# EasyEDA Pro project 空中鼠标发射端.epro

# Schematic 空中鼠标发射端
Board Name: 空中鼠标发射端; Create Date: 2025-04-13; Page Name: P1; Project Name: 空中鼠标; Schematic Name: 空中鼠标发射端; Update Date: 2025-04-16; Company: 嘉立创EDA; Page Size: A4; Version: V1.0
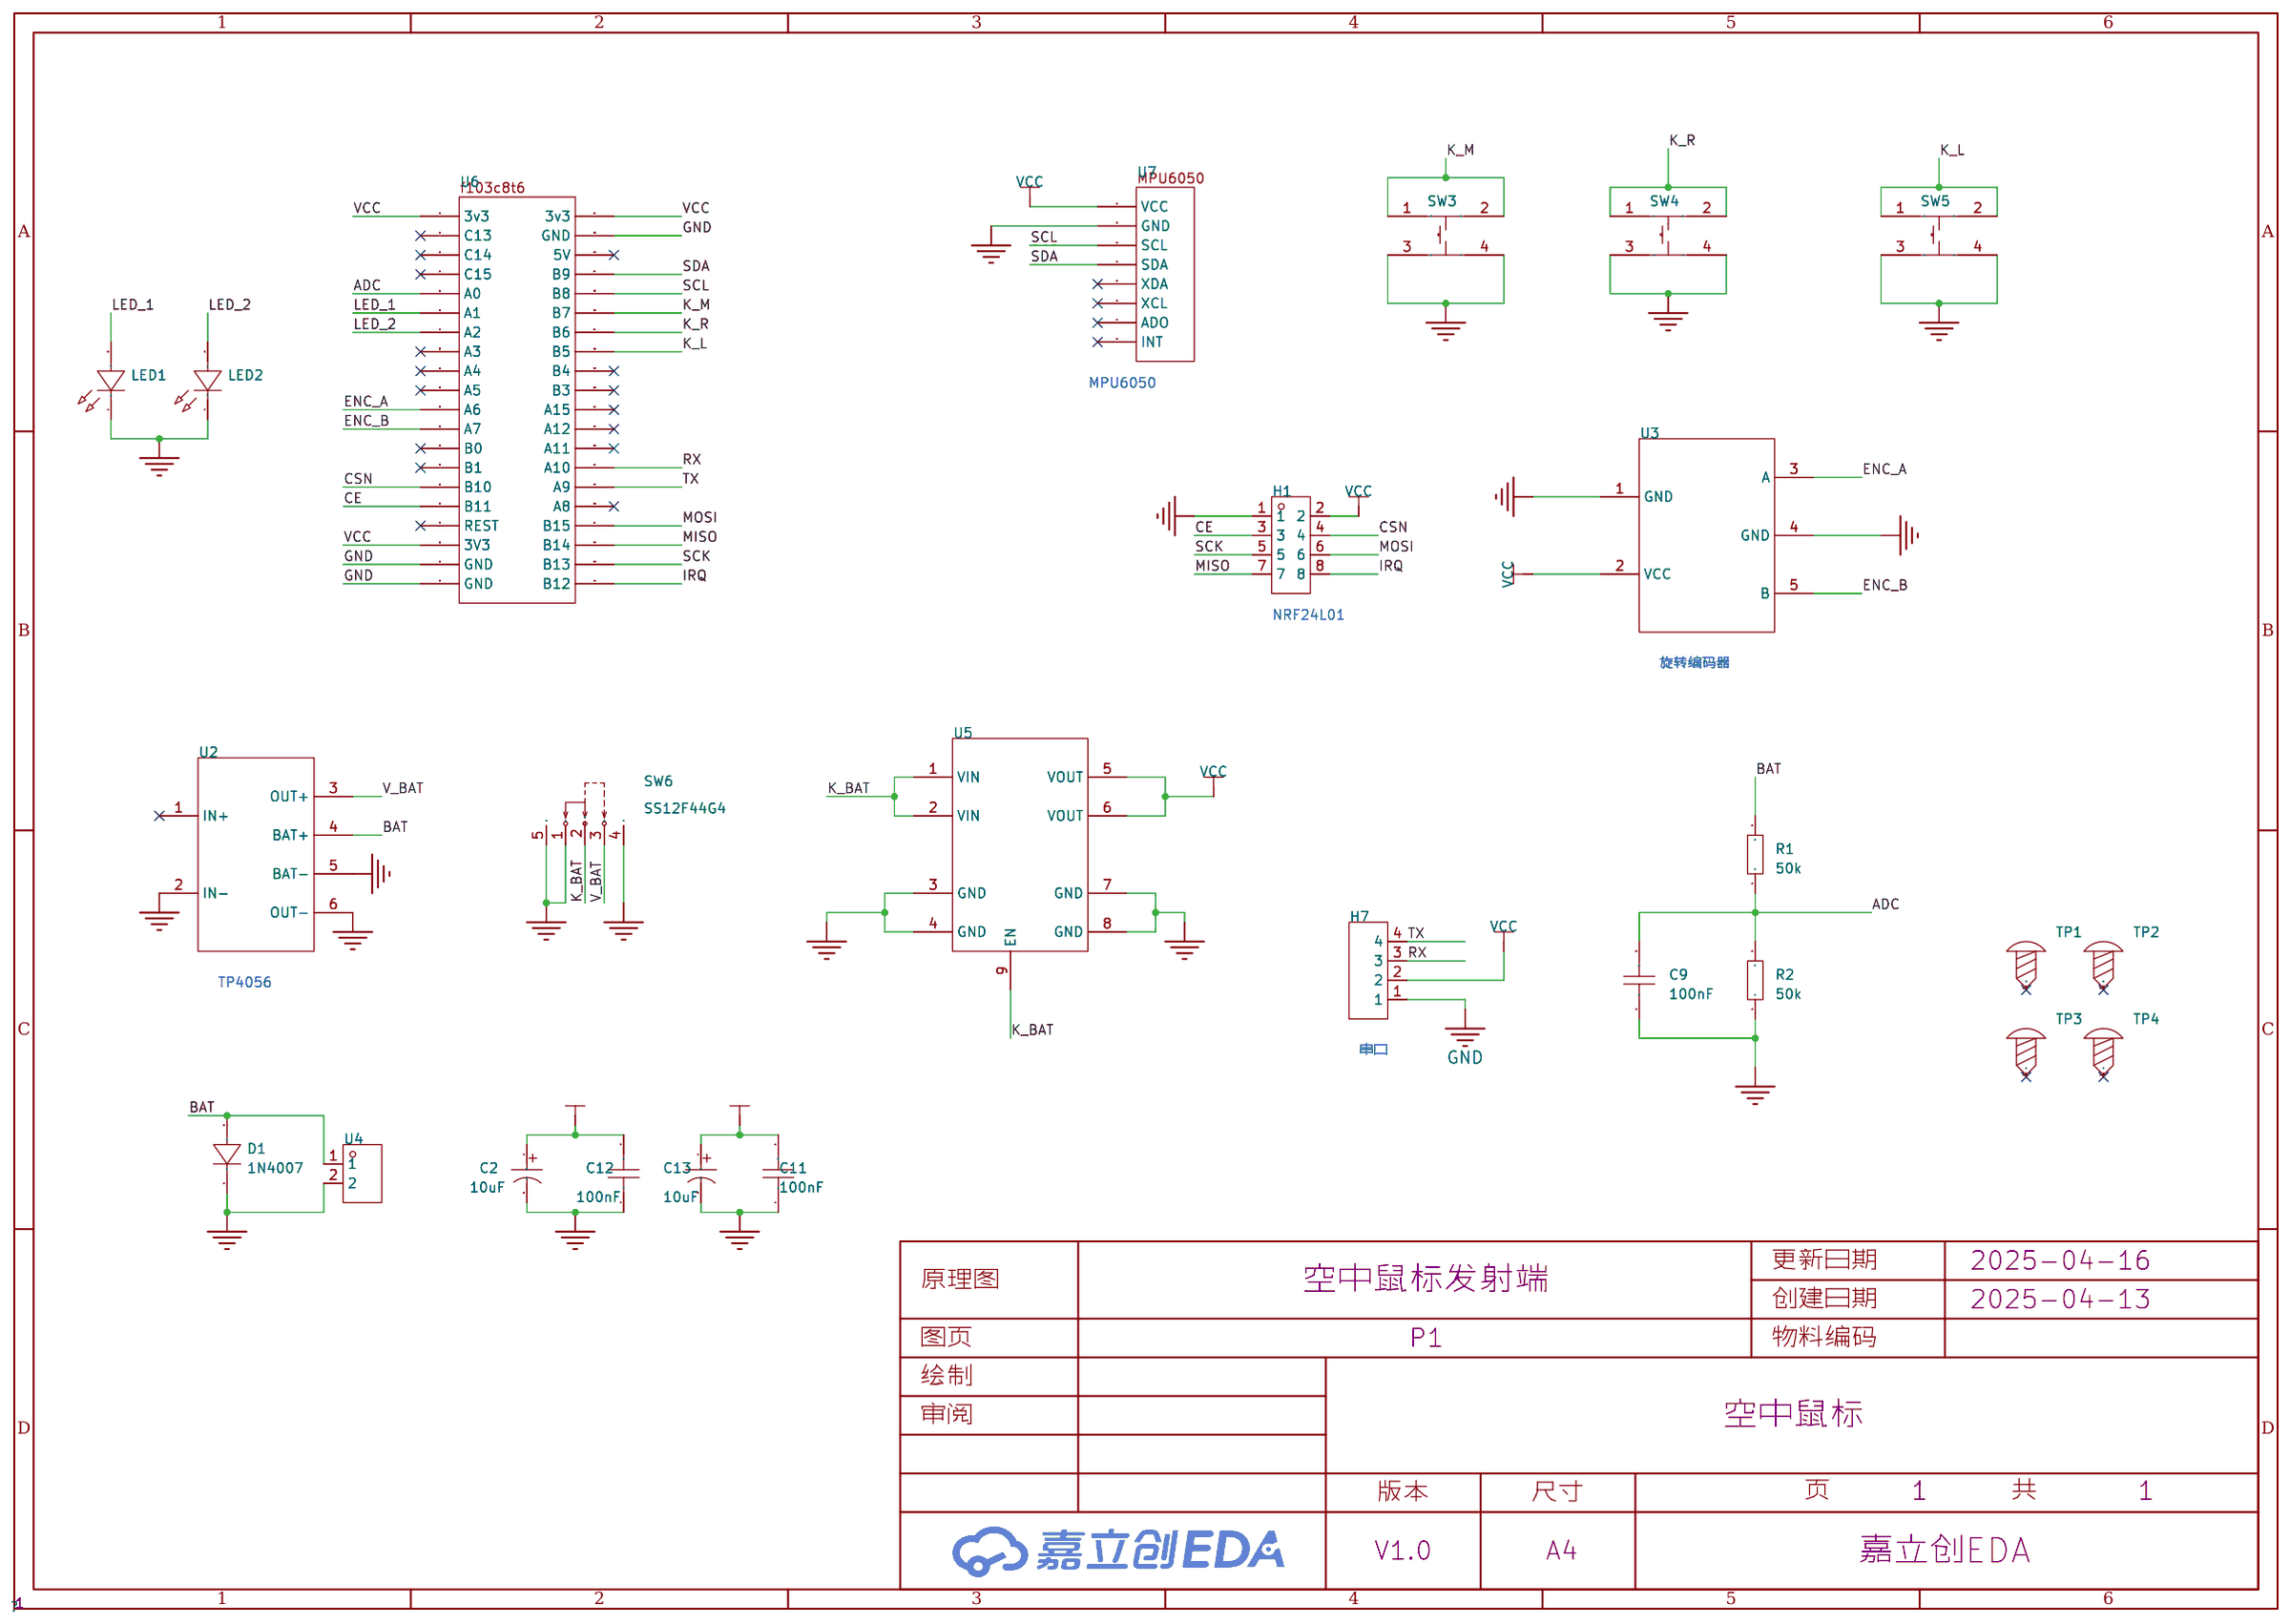
[diagram p0: schematic sheet]

## Parts
C2  10uF  [CAP-SMD_BD4.0-L4.3-W4.3-FD]
C9  100nF  [C0603]
C11  100nF  [C0603]
C12  100nF  [C0603]
C13  10uF  [CAP-SMD_BD4.0-L4.3-W4.3-FD]
D1  1N4007  [SMA_L4.3-W2.5-LS5.0-RD]
H1  NRF24L01  [HDR-TH_8P-P2.54-V-F-R2-C4-S2.54]
H7  -  [HDR-TH_4P-P2.54-V-M]
LED1  521-9210F  [LED-TH_BD3.0-P2.54-RD]
LED2  521-9210F  [LED-TH_BD3.0-P2.54-RD]
R1  50k  [R0603]
R2  50k  [R0603]
SCREW1  TP1  [M3螺丝]
SCREW2  TP2  [M3螺丝]
SCREW3  TP3  [M3螺丝]
SCREW4  TP4  [M3螺丝]
SW3  TS-1002-07026  [SW-TH_4P-L6.0-W6.0-P4.50-LS6.5]
SW4  TS-1002-07026  [SW-TH_4P-L6.0-W6.0-P4.50-LS6.5]
SW5  TS-1002-07026  [SW-TH_4P-L6.0-W6.0-P4.50-LS6.5]
SW6  SS12F44G4  [SW-TH_SHOU-HAN_SS12F44G4]
U2  -  [TP4056]
U3  -  [旋转编码器]
U4  XY-XHB2.54-2A21  [HDR-TH_2P-P2.50-H-F-W7.3-N]
U5  -  [TPS63000]
U6  -  [stm32f103c8t6最小系统板]
U7  -  [MPU6050]

## Library data of the parts
C2 C13 = RVT1V100M0405_C72485: 容值:10uF;精度:±20%;额定电压:35V;纹波电流:15mA@120Hz;等效串联电阻(ESR):-;; LCSC Part Name: 10uF ±20% 35V; Supplier Part: C72485; Manufacturer: ROQANG(容强); Manufacturer Part: RVT1V100M0405; Supplier Footprint: SMD,D4xL5.4mm; JLCPCB Part Class: 扩展库; Datasheet: https://atta.szlcsc.com/upload/public/pdf/source/20170325/1490427950282.pdf; Supplier: LCSC; Tolerance: ±20%; Voltage Rating: 35V; Ripple Current: 15mA@120Hz; Diameter: 4mm; Height - Seated (Max): 5.4mm; Lifetime: 2000hrs@105℃; Operating Temperature: -40℃~+105℃
C9 = CAP_0603: Supplier Footprint: 0603
C11 C12 = CC0603KRX7R9BB104: 容值:100nF;精度:±10%;额定电压:50V;材质(温度系数):X7R;; LCSC Part Name: 100nF ±10% 50V; Supplier Part: C14663; Manufacturer: YAGEO(国巨); Supplier Footprint: 0603; JLCPCB Part Class: 基础库; Datasheet: https://atta.szlcsc.com/upload/public/pdf/source/20180910/C282072_33301C7F631E79921B82A8DAC6BCC5B3.pdf; Supplier: LCSC; Tolerance: ±10%; Voltage Rated: 50V; Temperature Coefficient: X7R
D1 = 1N4007_C727081: 二极管配置:独立式;正向压降(Vf):1.1V@1A;直流反向耐压(Vr):1kV;整流电流:1A;; Supplier Part: C727081; Manufacturer: TWGMC(台湾迪嘉); Supplier Footprint: SMA(DO-214AC); JLCPCB Part Class: 扩展库; Datasheet: https://atta.szlcsc.com/upload/public/pdf/source/20200828/C727079_3A05254382567072883400655AE0ED46.pdf; Supplier: LCSC; Diode Configuration: 独立式; Forward Voltage (Vf@If): 1.1V@1A; Reverse Voltage (Vr): 1kV; Rectified Current: 1A; Reverse Leakage Current (Ir): 5uA
H1 = PM254V-12-08-H85: 插孔结构:2x4P;间距:2.54mm;行距:2.54mm;圆孔/方孔:方孔;安装类型:直插;排数:双排;总孔位数:8P;额定电流:3A;额定电压:250V;插孔方向:顶部;塑高:8.5mm;工作温度范围:-40℃~+105℃;; LCSC Part Name: 间距:2.54mm 2x4P 直插; Supplier Part: C2834799; Manufacturer: XFCN(兴飞); Supplier Footprint: 插件,P=2.54mm; JLCPCB Part Class: 扩展库; Datasheet: https://atta.szlcsc.com/upload/public/pdf/source/20200309/C492399_8C441E2934FBB604A89B37A68AA45ECF.pdf; Supplier: LCSC; Holes Structure: 2x4P; Pitch: 2.54mm; Row Spacing: 2.54mm; Circular Hole / Square Hole: 方孔; Mounting Type: 直插; Number of Rows: 双排; Number of Holes: 8P; Current Rating (Max): 3A; Voltage Rating (Max): 250V; Holes Direction: 顶部; Insulation Height: 8.5mm; Operating Temperature Range: -40℃~+105℃
H7 = HDR-M_2.54_1x4P: Supplier Part: C492403; Supplier Footprint: 插件
LED1 LED2 = 521-9210F: Supplier Part: C6075075; Manufacturer: Dialight; Supplier Footprint: 插件; Datasheet: https://atta.szlcsc.com/upload/public/pdf/source/20190108/C350939_6833FC1F7AEE099A9F4F0B49B6235C3A.pdf; Supplier: LCSC
R1 R2 = Res_0603: Supplier Footprint: 0603
SCREW1-SCREW4 = M3螺丝: Supplier Footprint: 插件
SW3-SW5 = TS-1002-07026: 电路结构:单刀单掷;按钮形状:圆形按钮;安装方式:直插;开关长度:6mm;开关宽度:6mm;开关高度:7mm;触点电流:50mA;额定电压(DC):12V;带灯:-;机械寿命:-;; LCSC Part Name: 6*6*7mm 直插 轻触开关; Supplier Part: C455095; Manufacturer: XUNPU(讯普); Supplier Footprint: 插件,6x6mm; JLCPCB Part Class: 扩展库; Datasheet: https://atta.szlcsc.com/upload/public/pdf/source/20231108/52BC6409AB52B6746CCC051A15664904.pdf; Supplier: LCSC; Circuit: 单刀单掷; Actuator Style: 圆形按钮; Mounting Style: 直插; Switch Length: 6mm; Switch Width: 6mm; Switch Height: 7mm; Contact Current: 50mA; Voltage Rating (DC): 12V
SW6 = SS12F44G4: 电路结构:单刀双掷;安装方式:直插;开关颜色:-;额定电流(DC):300mA;额定电压(DC):50V;额定电流(AC):-;额定电压(AC):-;机械寿命:5千次;; Supplier Part: C2887261; Manufacturer: SHOU HAN(首韩); Supplier Footprint: 插件; JLCPCB Part Class: 扩展库; Datasheet: https://atta.szlcsc.com/upload/public/pdf/source/20210820/C87A250874D550AF2167CED4FCF38A85.pdf; Supplier: LCSC; Circuit: 单刀双掷; Pin Style: PC引脚; Switch Length: 12mm; Switch Width: 4.5mm; Switch Height: 6mm; Mounting Style: 直插; Current Rating (DC): 300mA; Voltage Rating (DC): 50V; Mechanical Life: 5千次; Operating Temperature: -10℃~+50℃
U2 = TP4056模块
U3 = 旋转编码器
U4 = XY-XHB2.54-2A21: 插针结构:1x2P;间距:2.54mm;安装方式:弯插;总PIN数:2P;排数:1;每排PIN数:2;行距:2.54mm;额定电流:2A;工作温度范围:-25℃~+85℃;; LCSC Part Name: 1x2P 间距:2.54mm 弯插; Supplier Part: C19271395; Manufacturer: XYECONN(辛译); Supplier Footprint: 弯插,P=2.54mm; JLCPCB Part Class: 扩展库; Datasheet: https://atta.szlcsc.com/upload/public/pdf/source/20231124/E581531705911B495C6E735B7C4EA3F8.pdf; Supplier: LCSC; Pins Structure: 1x2P; Pitch: 2.54mm; Mounting Style: 弯插; Number of Pins: 2P; Number of Rows: 1; Number of PINs Per Row: 2; Row Spacing: 2.54mm; Current Rating (Max): 2A; Operating Temperature Range: -25℃~+85℃
U5 = TPS63000
U6 = stm32f103c8t6最小系统板
U7 = MPU6050

## Nets
GND: C2.2 C9.1 C11.1 C12.1 C13.2 D1.1(K) H1.1 H7.1 LED1.1(K) LED2.1(K) R2.1 SW3.3 SW3.4 SW4.3 SW4.4 SW5.3 SW5.4 SW6.1 SW6.4 SW6.5 U2.2(IN-) U2.5(BAT-) U2.6(OUT-) U3.1(GND) U3.4(GND) U4.2 U5.3(GND) U5.4(GND) U5.7(GND) U5.8(GND) U6.19(GND) U6.20(GND) U6.22(GND) U7.2(GND)
VCC: C11.2 C13.1 H1.2 H7.2 U3.2(VCC) U5.5(VOUT) U5.6(VOUT) U6.1(3v3) U6.18(3V3) U6.21(3v3) U7.1(VCC)
ADC: C9.2 R1.1 R2.2 U6.5(A0)
BAT: D1.2(A) R1.2 U2.4(BAT+) U4.1
CE: H1.3 U6.16(B11)
CSN: H1.4 U6.15(B10)
ENC_A: U3.3(A) U6.11(A6)
ENC_B: U3.5(B) U6.12(A7)
IRQ: H1.8 U6.40(B12)
K_BAT: C2.1 C12.2 SW6.2 U5.1(VIN) U5.2(VIN) U5.9(EN)
K_L: SW5.1 SW5.2 U6.28(B5)
K_M: SW3.1 SW3.2 U6.26(B7)
K_R: SW4.1 SW4.2 U6.27(B6)
LED_1: LED1.2(A) U6.6(A1)
LED_2: LED2.2(A) U6.7(A2)
MISO: H1.7 U6.38(B14)
MOSI: H1.6 U6.37(B15)
RX: H7.3 U6.34(A10)
SCK: H1.5 U6.39(B13)
SCL: U6.25(B8) U7.3(SCL)
SDA: U6.24(B9) U7.4(SDA)
TX: H7.4 U6.35(A9)
V_BAT: SW6.3 U2.3(OUT+)

Not connected (* = marked no-connect by the designer): SCREW1 1*; SCREW2 1*; SCREW3 1*; SCREW4 1*; U2 1(IN+)*; U6 2(C13)* 3(C14)* 4(C15)* 8(A3)* 9(A4)* 10(A5)* 13(B0)* 14(B1)* 17(REST)* 23(5V)* 29(B4)* 30(B3)* 31(A15)* 32(A12)* 33(A11)* 36(A8)*; U7 5(XDA)* 6(XCL)* 7(ADO)* 8(INT)*

## Notes on the sheet
- MPU6050
- NRF24L01
- 旋转编码器
- TP4056
- 串口

# Board PCB2_1
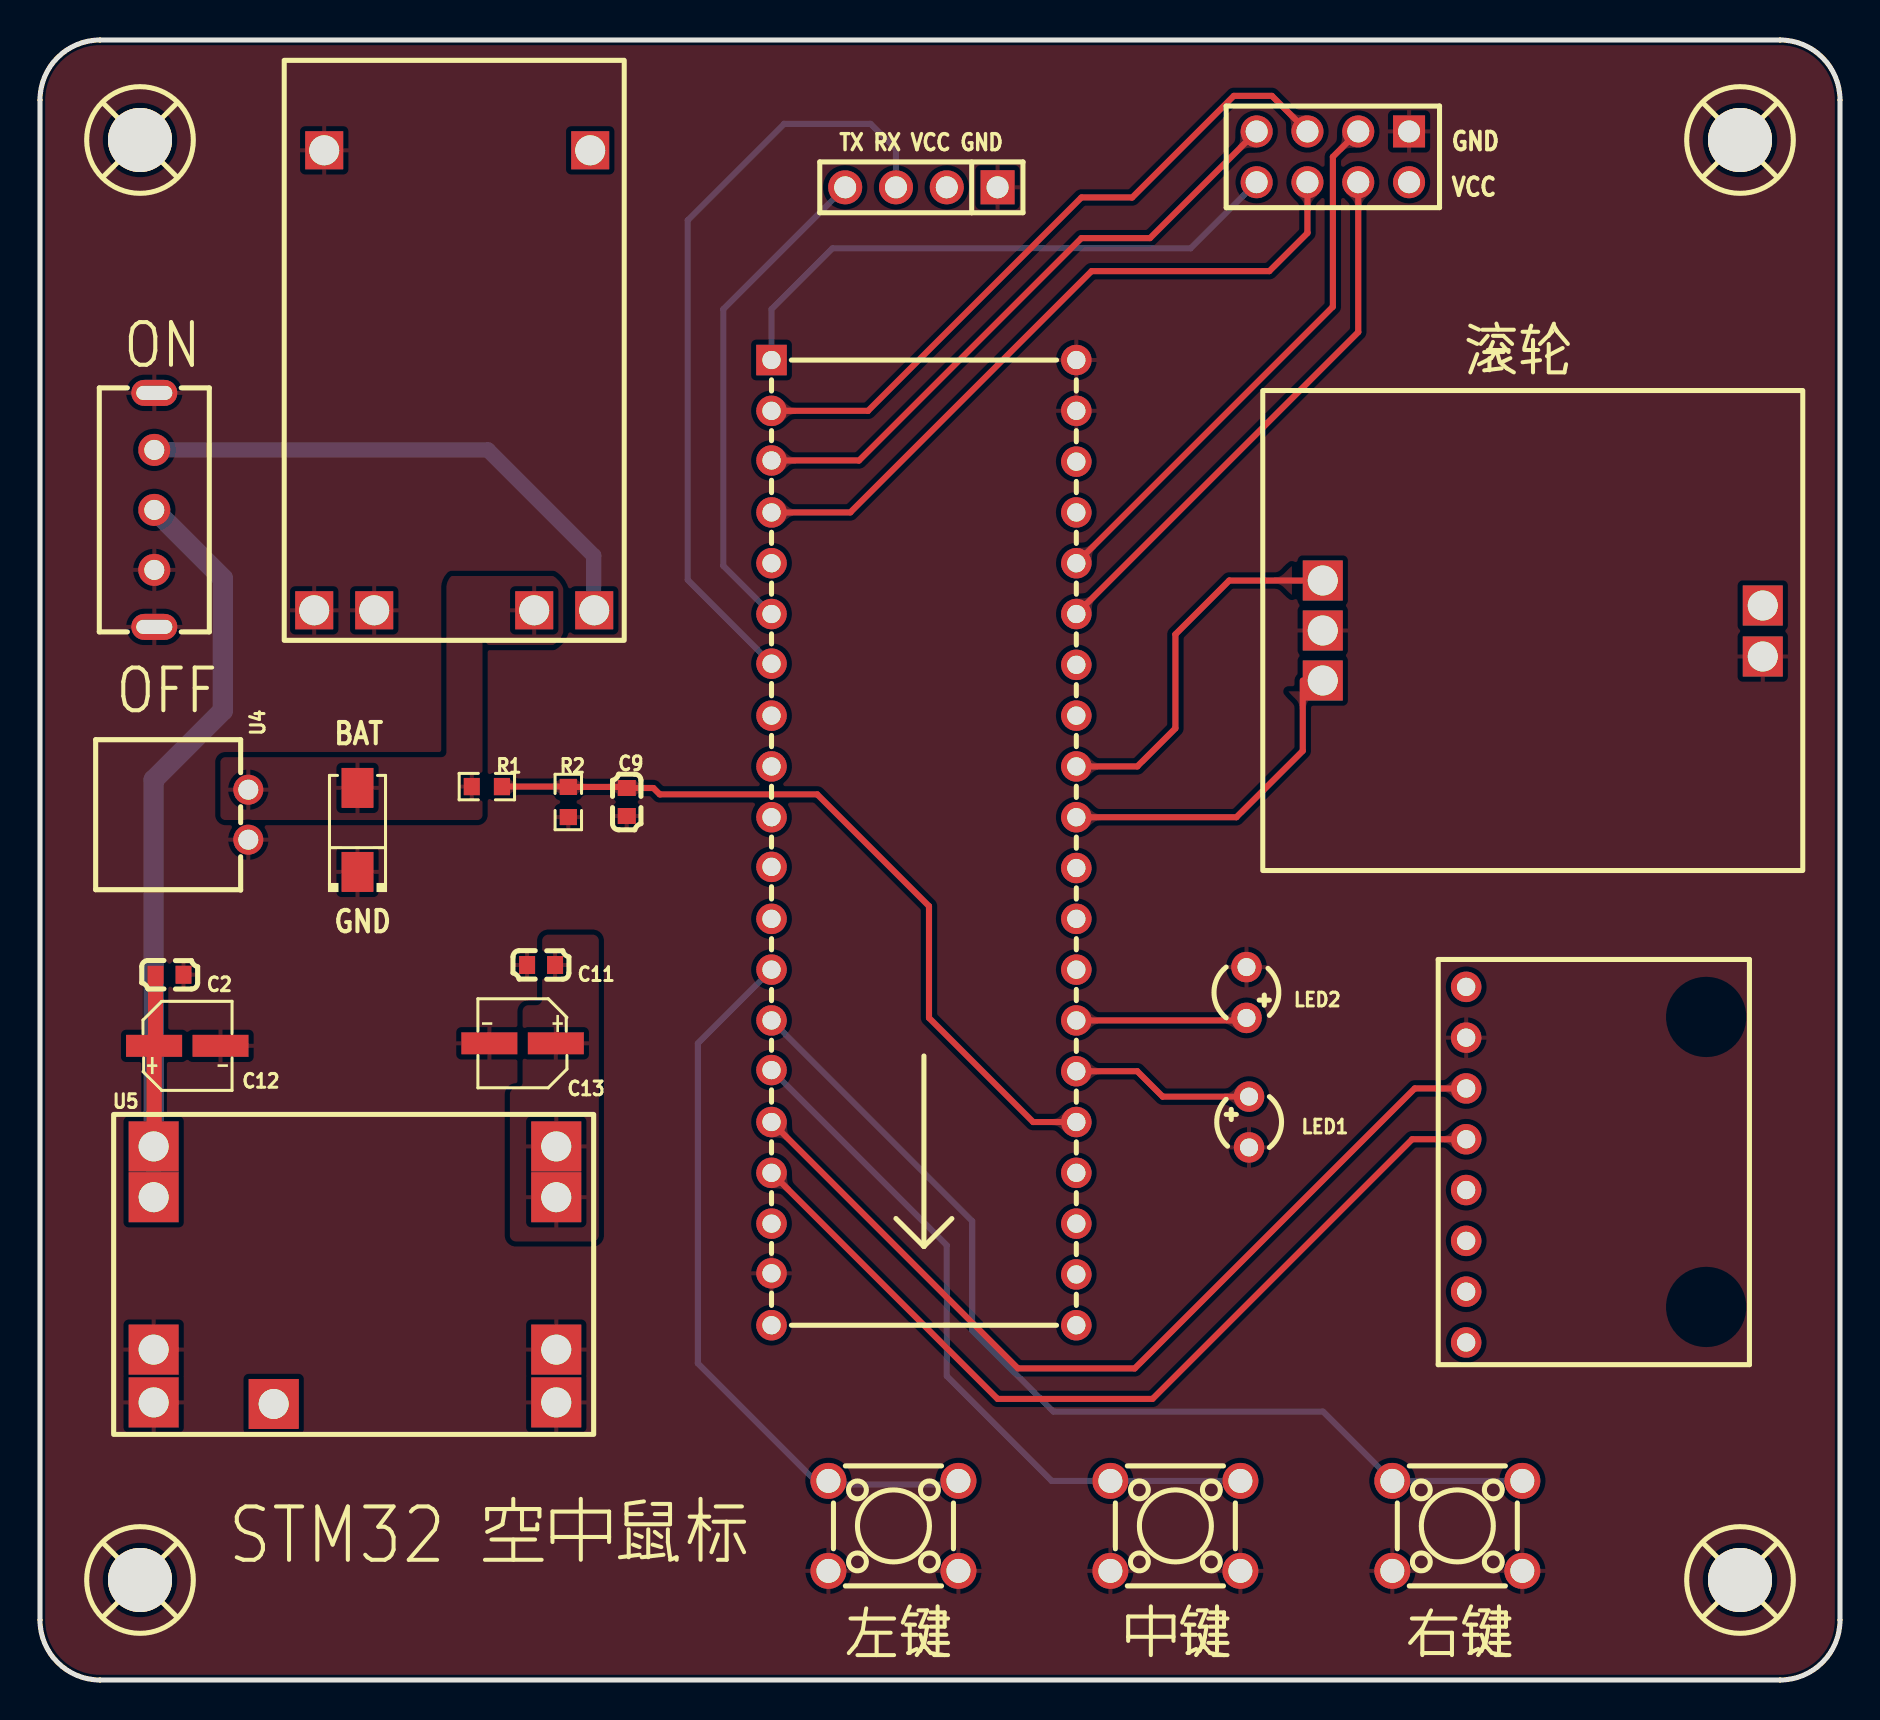
[diagram p1: board, top side]
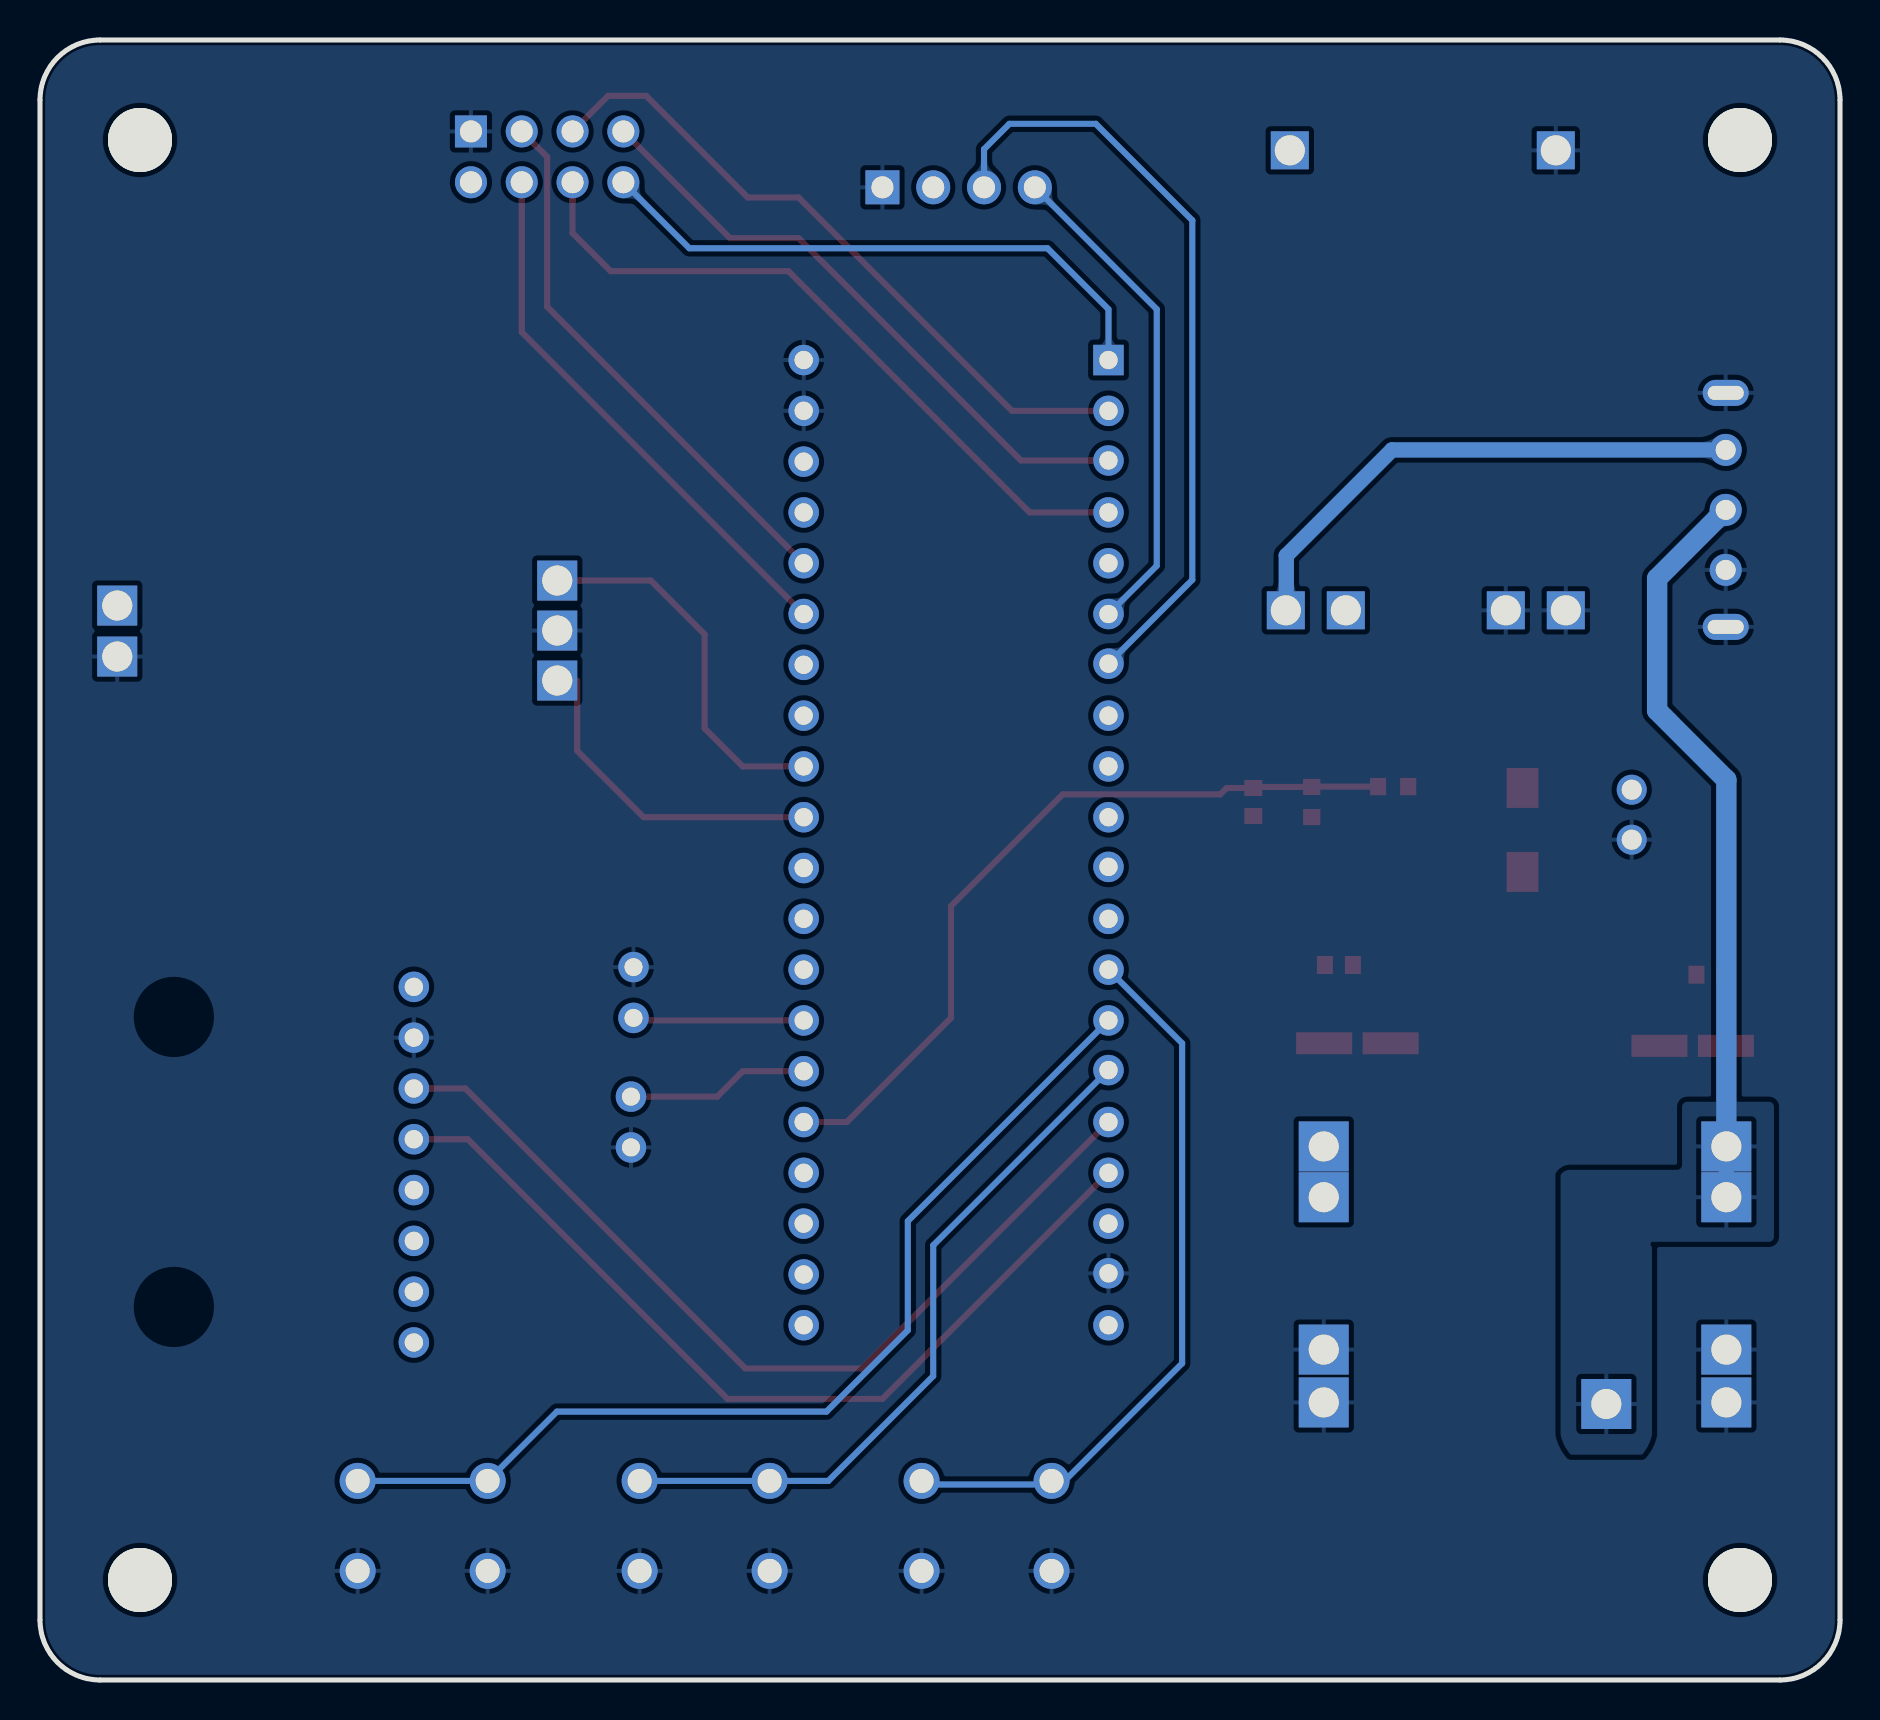
[diagram p2: board, bottom side, seen from below]

Outline 90 x 82 mm; copper layers: Top Layer, Inner1, Inner2, Bottom Layer. Coordinates in mm from the lower left corner of the outline.
Outline path: 0,79 0,3 arc(0.88,0.88) 3,0 87,0 arc(89.12,0.88) 90,3 90,79 arc(89.12,81.12) 87,82 3,82 arc(0.88,81.12) 0,79
Stack: Top Layer 0.035mm 外层铜厚1oz / Dielectric1 0.2104mm 7628 RC49% 8.6mil / Inner1 0.0152mm 内层铜厚 / Dielectric2 1.065mm 1.1mm H/HOZ Copper / Inner2 0.0152mm 内层铜厚 / Dielectric3 0.2104mm 7628 RC49% 8.6mil / Bottom Layer 0.035mm 外层铜厚1oz

## Design rules (mm)
template: 自定义配置
spacing copperThickness1oz (default): track to track 0.102, other pairs 0.152 to 0.3
spacing copperThickness2oz: track to track 0.203, other pairs 0.152 to 0.3
track width copperThickness1oz (default): min 0.127, default 0.305, max 2.54
track width copperThickness2oz: min 0.203, default 0.254, max 2.54
differential pair differentialPair (default): width min 0.127, default 0.254, max 2.54; gap min 0.152, default 0.152
via viaSize (default): diameter min 0.5, default 0.61, max 10; hole min 0.3, default 0.305, max 6.299
net BAT uses copperRegion1

## Placement (name value [footprint] x y rotation side)
C2  10uF  [CAP-SMD_BD4.0-L4.3-W4.3-FD]  7.37 31.71 0 top
C9  100nF  [C0603]  29.34 43.9 90 top
C11  100nF  [C0603]  25.06 35.75 0 top
C12  100nF  [C0603]  6.48 35.26 180 top
C13  10uF  [CAP-SMD_BD4.0-L4.3-W4.3-FD]  24.13 31.83 180 top
D1  1N4007  [SMA_L4.3-W2.5-LS5.0-RD]  15.88 42.5 90 top
H1  NRF24L01  [HDR-TH_8P-P2.54-V-F-R2-C4-S2.54]  64.64 76.16 180 top
H7  -  [HDR-TH_4P-P2.54-V-M]  44.07 74.63 180 top
LED1  521-9210F  [LED-TH_BD3.0-P2.54-RD]  60.45 27.9 90 top
LED2  521-9210F  [LED-TH_BD3.0-P2.54-RD]  60.32 34.38 270 top
R1  50k  [R0603]  22.34 44.67 180 top
R2  50k  [R0603]  26.42 43.9 90 top
SCREW1  TP1  [M3螺丝]  5 5 270 top
SCREW2  TP2  [M3螺丝]  85 77 270 top
SCREW3  TP3  [M3螺丝]  5 77 270 top
SCREW4  TP4  [M3螺丝]  85 5 270 top
SW3  TS-1002-07026  [SW-TH_4P-L6.0-W6.0-P4.50-LS6.5]  56.77 7.71 0 top
SW4  TS-1002-07026  [SW-TH_4P-L6.0-W6.0-P4.50-LS6.5]  70.87 7.71 0 top
SW5  TS-1002-07026  [SW-TH_4P-L6.0-W6.0-P4.50-LS6.5]  42.67 7.71 0 top
SW6  SS12F44G4  [SW-TH_SHOU-HAN_SS12F44G4]  5.72 58.5 90 top
U2  -  [TP4056]  29.21 80.98 270 top
U3  -  [旋转编码器]  88.14 64.47 270 top
U4  XY-XHB2.54-2A21  [HDR-TH_2P-P2.50-H-F-W7.3-N]  10.41 43.27 270 top
U5  -  [TPS63000]  3.68 28.28 0 top
U6  -  [stm32f103c8t6最小系统板]  51.94 17.86 180 top
U7  -  [MPU6050]  85.47 36.03 270 top

## Footprints (pads in the part's own frame, mm; a bottom-side part is the same pattern mirrored in y, then rotated)
C0603
  rect 0.8x0.9 smd: 1(-0.7,0) 2(0.7,0)
CAP-SMD_BD4.0-L4.3-W4.3-FD
  rect 2.8x1.1 smd: 1(-1.661,0) 2(1.661,0)
HDR-TH_2P-P2.50-H-F-W7.3-N
  round 1.5 hole 1: 1(-1.25,0) 2(1.25,0)
HDR-TH_4P-P2.54-V-M
  rect 1.7x1.7 hole 1.1: 1(-3.81,0)
  round 1.7 hole 1.1: 2(-1.27,0) 3(1.27,0) 4(3.81,0)
HDR-TH_8P-P2.54-V-F-R2-C4-S2.54
  rect 1.6x1.6 hole 1.1: 1(-3.81,-1.27)
  round 1.6 hole 1.1: 2(-3.81,1.27) 3(-1.27,-1.27) 4(-1.27,1.27) 5(1.27,-1.27) 6(1.27,1.27) 7(3.81,-1.27) 8(3.81,1.27)
LED-TH_BD3.0-P2.54-RD
  round 1.524 hole 0.9: 1(-1.27,0) 2(1.27,0)
M3螺丝
  round 3.2 hole 3.2: 1(0,0)
MPU6050
  round 1.524 hole 0.914: 1(1.369,-14.163) 2(3.909,-14.163) 3(6.449,-14.163) 4(8.989,-14.163) 5(11.529,-14.163) 6(14.069,-14.163) 7(16.609,-14.163) 8(19.149,-14.163)
R0603
  rect 0.806x0.864 smd: 1(-0.753,0) 2(0.753,0)
SMA_L4.3-W2.5-LS5.0-RD
  rect 2x1.593 smd: 1(-2.1,0) 2(2.1,0)
stm32f103c8t6最小系统板
  round 1.524 hole 0.914: 1(0.127,0.127) 2(0.127,-2.413) 3(0.127,-4.953) 4(0.127,-7.493) 5(0.127,-10.033) 6(0.127,-12.573) 7(0.127,-15.113) 8(0.127,-17.653) 9(0.127,-20.193) 10(0.127,-22.733) 11(0.127,-25.273) 12(0.127,-27.813) 13(0.127,-30.353) 14(0.127,-32.893) 15(0.127,-35.433) 16(0.127,-37.973) 17(0.127,-40.513) 18(0.127,-43.053) 19(0.127,-45.593) 20(0.127,-48.133) 21(15.367,0.127) 22(15.367,-2.471) 23(15.367,-4.953) 24(15.367,-7.493) 25(15.367,-10.033) 26(15.367,-12.631) 27(15.367,-15.113) 28(15.367,-17.653) 29(15.367,-20.193) 30(15.367,-22.791) 31(15.367,-25.273) 32(15.367,-27.813) 33(15.367,-30.353) 34(15.367,-32.951) 35(15.367,-35.433) 36(15.367,-37.973) 37(15.367,-40.513) 38(15.367,-43.111) 39(15.367,-45.593)
  rect 1.524x1.524 hole 0.914: 40(15.367,-48.133)
SW-TH_4P-L6.0-W6.0-P4.50-LS6.5
  round 1.8 hole 1.2: 1(-3.25,2.25) 2(3.25,2.25) 3(-3.25,-2.25) 4(3.25,-2.25)
SW-TH_SHOU-HAN_SS12F44G4
  round 1.6 hole 1: 1(-3,0) 2(0,0) 3(3,0)
  oval 1.3x2.3 hole 0.7x1.8: 4(5.85,0) 5(-5.85,0)
TP4056
  rect 1.9x1.9 hole 1.5: 1(4.5,-1.7) 2(4.5,-15) 3(27.5,-1.5) 4(27.5,-4.5) 5(27.5,-12.5) 6(27.5,-15.5)
TPS63000
  rect 2.5x2.5 hole 1.5: 1(2,-1.6) 2(2,-4.14) 3(2,-11.76) 4(2,-14.4) 5(22.13,-1.6) 6(22.13,-4.14) 7(22.13,-11.76) 8(22.13,-14.4) 9(8.001,-14.478)
旋转编码器
  rect 2x2 hole 1.5: 1(13.3,-2) 2(10.75,-2) 3(14.5,-24) 4(12,-24) 5(9.5,-24)

## Nets
As in the schematic.

Pads without a net: SCREW1 1; SCREW2 1; SCREW3 1; SCREW4 1; U2 1; U6 2 3 4 8 9 10 13 14 17 23 29 30 31 32 33 36; U7 5 6 7 8

## Routing (per net, layer and track width the routed paths; a pad name or vN(x,y) marks a point on that pad's centre or on a via; arc(x,y) is an arc through that point)
ADC: length 38.9
  Top Layer w0.305: 23.1,44.67 26.4,44.67 R2.2 29.28,44.65 C9.2 30.67,44.6 30.99,44.28 38.86,44.28 44.45,38.69 44.45,33.11 49.66,27.9 U6.5
CE: length 27.4
  Top Layer w0.305: U6.16 64.64,68.67 64.64,76.16 H1.3
CSN: length 27.4
  Top Layer w0.305: H1.4 65.91,67.39 U6.15
ENC_A: length 16.2
  Top Layer w0.305: U6.11 59.82,43.14 63.14,46.46 63.14,49.97
ENC_B: length 17.9
  Top Layer w0.305: U6.12 54.86,45.68 56.77,47.58 56.77,52.28 59.46,54.97 63.14,54.97
IRQ: length 29.4
  Bottom Layer w0.305: H1.8 57.53,71.59 39.62,71.59 36.58,68.54 U6.40
K_BAT: length 45.8
  Top Layer w0.762: C12.2 5.78,31.78 C2.1 5.71,26.7 U5.1
  Bottom Layer w0.762: U5.1 U5.2
  Bottom Layer w1.016: SW6.2 9.14,55.08 9.14,48.47 5.68,45.01 U5.1
K_L: length 36.8
  Bottom Layer w0.305: SW5.2 45.74,9.78 39.6,9.78 SW5.1 38.77,9.96 32.89,15.83 32.89,31.83 U6.28
K_M: length 35.8
  Bottom Layer w0.305: SW3.2 SW3.1 50.58,9.96 45.34,15.2 45.34,21.73 U6.26
K_R: length 50.3
  Bottom Layer w0.305: SW4.2 SW4.1 64.15,13.42 50.67,13.42 46.61,17.48 46.61,22.94 U6.27
LED_1: length 9.2
  Top Layer w0.305: LED1.2 56.13,29.17 54.86,30.44 U6.6
LED_2: length 8.6
  Top Layer w0.305: U6.7 60.07,32.98 60.32,32.72
MISO: length 31.1
  Top Layer w0.305: U6.38 40.95,60.98 52.07,72.09 55.5,72.09 H1.7
MOSI: length 35.1
  Top Layer w0.305: U6.37 40.51,58.38 52.58,70.44 61.47,70.44 63.37,72.35 H1.6
RX: length 38.7
  Bottom Layer w0.305: U6.34 32.38,55.01 32.38,72.98 37.21,77.81 41.53,77.81 42.8,76.54 42.8,74.63
SCK: length 34.1
  Top Layer w0.305: H1.5 61.59,79.21 59.69,79.21 54.61,74.13 52.07,74.13 41.4,63.46 U6.39
SCL: length 45.6
  Top Layer w0.305: U6.25 48.9,15.58 54.74,15.58 68.74,29.58 U7.3
SDA: length 44.8
  Top Layer w0.305: U7.4 68.61,27.04 55.63,14.06 47.88,14.06 U6.24
TX: length 24.9
  Bottom Layer w0.305: U6.35 34.16,55.71 34.16,68.54 H7.4
V_BAT: length 26.9
  Bottom Layer w0.762: SW6.3 22.4,61.5 27.69,56.22 27.69,53.51 U2.3

## Copper pours and planes (outline as drawn; the poured copper is in the pictures)
GND on Top Layer: -6.86,89.49 99.06,89.49 99.06,-10.2 -6.86,-10.2
GND on Bottom Layer: -10.03,91.02 104.39,91.02 104.39,-10.58 -10.03,-10.58
GND on Inner1: 0.26,81.74 89.74,81.74 89.74,0.26 0.26,0.26
VCC on Top Layer: 27.64,37.27 27.85,37.18 27.94,36.96 27.94,22.23 27.85,22.02 27.64,21.93 23.8,21.93 23.58,22.02 23.5,22.23 23.5,29.28 23.58,29.49 23.8,29.58 23.83,29.58 24.04,29.67 24.13,29.89 24.13,33.43 24.22,33.65 24.44,33.74 24.81,33.74 25.02,33.83 25.11,34.04 25.11,36.96 25.2,37.18 25.42,37.27
VCC on Inner2: 0.26,81.74 89.74,81.74 89.74,0.26 0.26,0.26
BAT on Top Layer: 21.87,43 22.05,43.07 22.12,43.25 22.12,51.87 22.29,51.88 22.38,51.75 25.65,51.75 25.97,52.02 26.16,52.38 26.16,54.57 25.97,54.93 25.65,55.2 20.57,55.2 20.38,54.91 20.32,54.57 20.32,46.39 20.25,46.21 20.07,46.14 9.27,46.14 9.09,46.07 9.02,45.89 9.02,43.25 9.09,43.07 9.27,43
K_BAT on Bottom Layer: 8.15,25.5 7.97,25.58 7.89,25.76 7.89,28.66 7.82,28.84 7.64,28.91 3.56,28.91 3.38,28.84 3.3,28.66 3.3,22.16 3.38,21.98 3.56,21.91 9.4,21.91 9.47,21.78 9.4,21.66 9.4,12.28 9.59,11.74 9.91,11.26 13.46,11.26 13.78,11.74 13.97,12.28 13.97,25.25 13.75,25.44 13.46,25.5

Small or netless copper shapes (teardrops, artwork), in the pictures only: 28 on Top Layer, 9 on Bottom Layer, 101 on Inner1, 33 on Inner2

## Text on the board
Top Silkscreen Layer: TX RX VCC GND | GND | VCC | BAT | OFF | ON | 左键 | 中键 | 右键 | 滚轮 | STM32 空中鼠标
